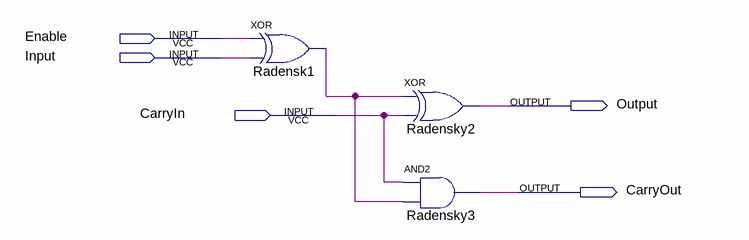
[diagram p0: schematic sheet]
// Quartus schematic 2compliment_adder.bdf as structural Verilog: 3 symbols, 5 pins
module \2compliment_adder  (
  input  Enable,
  input  Input,
  input  CarryIn,
  output Output,
  output CarryOut
);

  wire Radensk1_out;

  xor Radensk1 (Radensk1_out, Enable, Input);
  xor Radensky2 (Output, Radensk1_out, CarryIn);
  and Radensky3 (CarryOut, CarryIn, Radensk1_out);
endmodule
